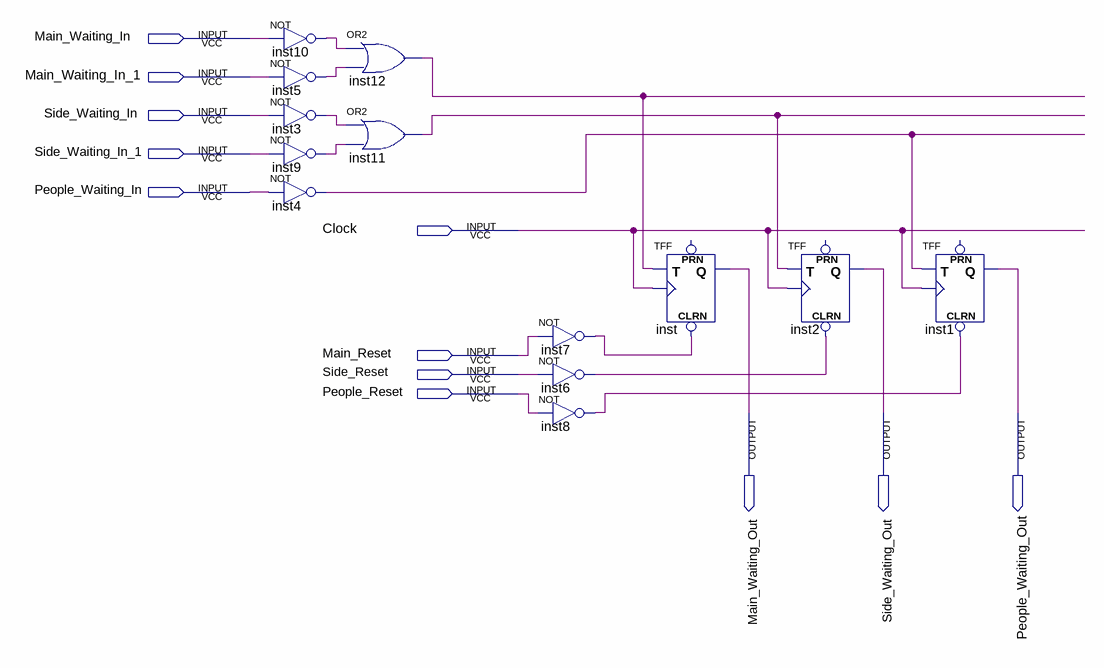
[diagram p0: schematic sheet]
// Quartus schematic Inputs_Flip_Flop.bdf as structural Verilog: 13 symbols, 12 pins
module Inputs_Flip_Flop (
  input  Main_Waiting_In,
  input  Main_Waiting_In_1,
  input  Side_Waiting_In,
  input  Side_Waiting_In_1,
  input  People_Waiting_In,
  input  Clock,
  input  Main_Reset,
  input  Side_Reset,
  input  People_Reset,
  output Main_Waiting_Out,
  output Side_Waiting_Out,
  output People_Waiting_Out
);

  wire inst3_out, inst4_out, inst5_out, inst6_out, inst7_out, inst8_out, inst9_out, inst10_out, inst11_out,
       inst12_out;

  not inst10 (inst10_out, Main_Waiting_In);
  not inst5 (inst5_out, Main_Waiting_In_1);
  not inst3 (inst3_out, Side_Waiting_In);
  not inst9 (inst9_out, Side_Waiting_In_1);
  not inst4 (inst4_out, People_Waiting_In);
  or inst12 (inst12_out, inst10_out, inst5_out);
  or inst11 (inst11_out, inst3_out, inst9_out);
  not inst7 (inst7_out, Main_Reset);
  not inst6 (inst6_out, Side_Reset);
  not inst8 (inst8_out, People_Reset);
  TFF inst (.CLRN(inst7_out), .T(inst12_out), .CLK(Clock), .Q(Main_Waiting_Out));  // open: PRN
  TFF inst2 (.CLRN(inst6_out), .T(inst11_out), .CLK(Clock), .Q(Side_Waiting_Out));  // open: PRN
  TFF inst1 (.CLRN(inst8_out), .T(inst4_out), .CLK(Clock), .Q(People_Waiting_Out));  // open: PRN
endmodule
